# Altium schematic sheet GPSR_v2.SchDoc: Dual Antenna GPSR
size A3; CompanyName: NCTU; Address1: NCTU; DocumentNumber: 1; Revision: 1803; SheetNumber: 1; SheetTotal: 1
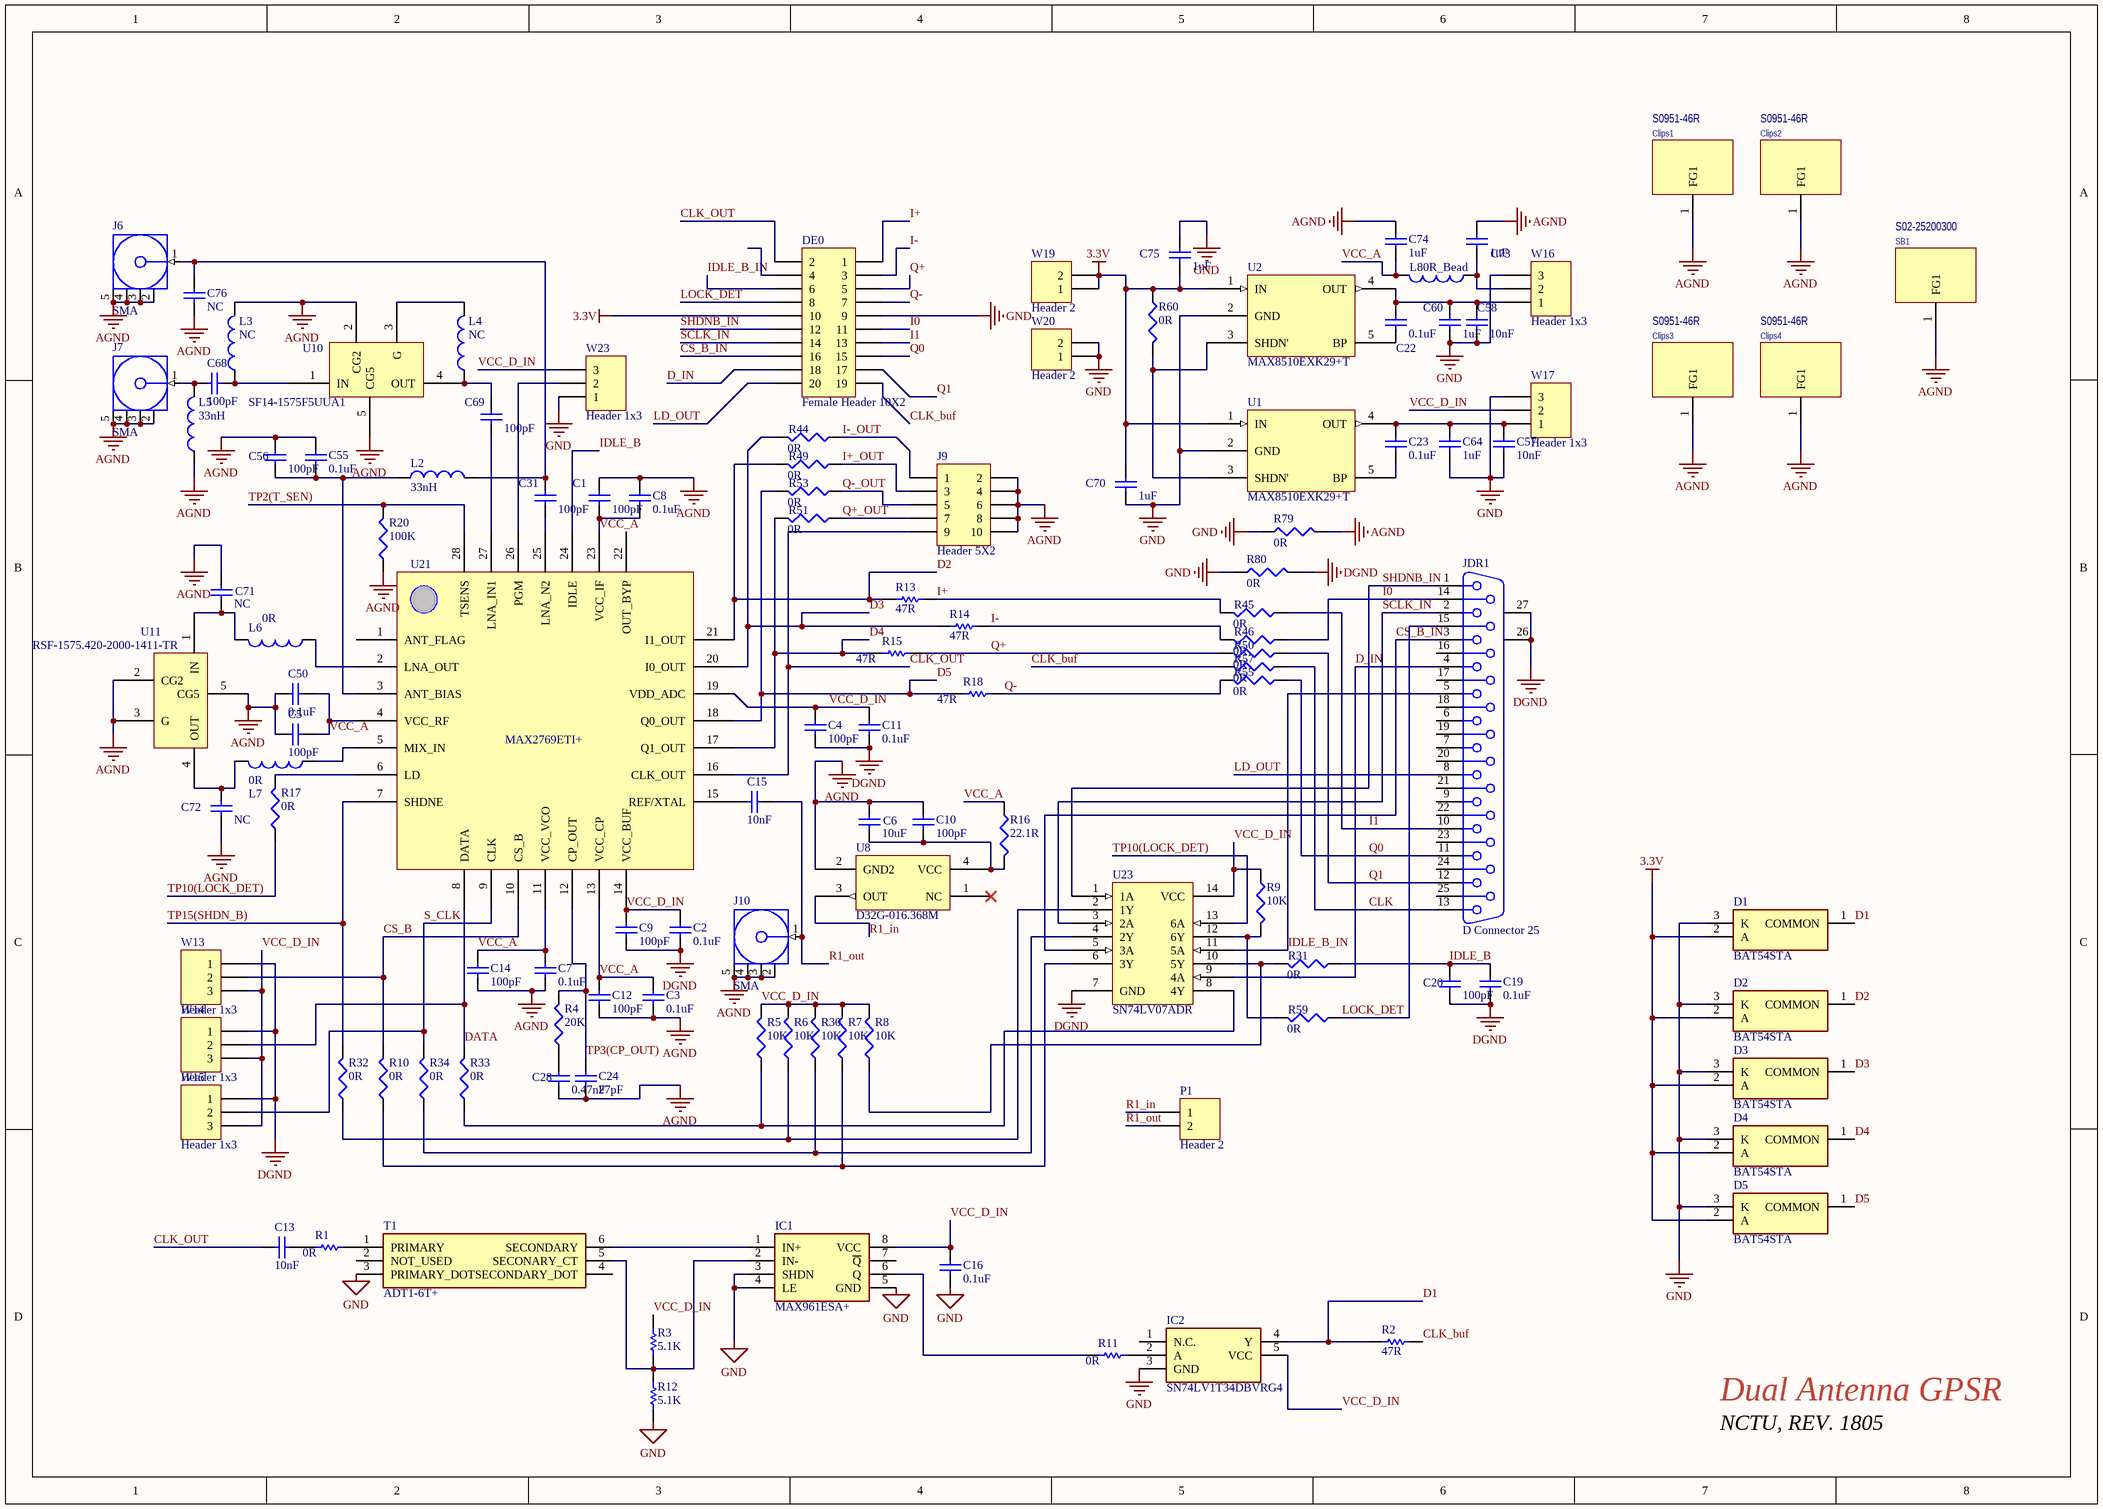
[diagram p0: GPSR_v2.SchDoc]

## Parts
C1  100pF  [C0402]
C2  0.1uF  [C0402]
C3  0.1uF  [C0402]
C4  100pF  [C0402]
C5  100pF  [C0402]
C6  10uF  [C0402]
C7  0.1uF  [C0402]
C8  0.1uF  [C0402]
C9  100pF  [C0402]
C10  100pF  [C0402]
C11  0.1uF  [C0402]
C12  100pF  [C0402]
C13  10nF  [C1210]
C14  100pF  [C0402]
C15  10nF  [C0402]
C16  0.1uF  [C1210]
C19  0.1uF  [C0402]
C20  100pF  [C0402]
C22  0.1uF  [C0402]
C23  0.1uF  [C0402]
C24  27pF  [C0402]
C28  0.47nF  [C0402]
C31  100pF  [C0402]
C50  0.1uF  [C0402]
C55  0.1uF  [C0402]
C56  100pF  [C0402]
C57  10nF  [C0402]
C58  10nF  [C0402]
C60  1uF  [C0402]
C64  1uF  [C0402]
C68  100pF  [C0402]
C69  100pF  [C0402]
C70  1uF  [C0402]
C71  NC  [C0402]
C72  NC  [C0402]
C73  1uF  [C0402]
C74  1uF  [C0402]
C75  1uF  [C0402]
C76  NC  [C0402]
Clips1  S0951-46R  [S0951-46R]
Clips2  S0951-46R  [S0951-46R]
Clips3  S0951-46R  [S0951-46R]
Clips4  S0951-46R  [S0951-46R]
D1  BAT54STA  [SOT23_M]
D2  BAT54STA  [SOT23_M]
D3  BAT54STA  [SOT23_M]
D4  BAT54STA  [SOT23_M]
D5  BAT54STA  [SOT23_M]
DE0  Female Header 10X2  [HDR2X10]
IC1  MAX961ESA+  [SOIC127P600X175-8N]
IC2  SN74LV1T34DBVRG4  [SOT95P280X145-5N]
J6  SMA  [SMA-JACK]
J7  SMA  [SMA-JACK]
J9  Header 5X2  [HDR2X5]
J10  SMA  [SMA-JACK]
JDR1  D Connector 25  [DSUB1.385-2H25A]
L2  33nH  [0402-A]
L3  NC  [0402-A]
L4  NC  [0402-A]
L5  33nH  [0402-A]
L6  0R  [0402-A]
L7  0R  [0402-A]
L8  0R_Bead  [0402-A]
P1  Header 2  [HDR1X2]
R1  0R  [6-0805_N]
R2  47R  [6-0805_N]
R3  5.1K  [6-0805_N]
R4  20K  [R0402]
R5  10K  [R0402]
R6  10K  [R0402]
R7  10K  [R0402]
R8  10K  [R0402]
R9  10K  [R0402]
R10  0R  [6-0805_N]
R11  0R  [6-0805_N]
R12  5.1K  [6-0805_N]
R13  47R  [6-0805_N]
R14  47R  [6-0805_N]
R15  47R  [6-0805_N]
R16  22.1R  [R0402]
R17  0R  [6-0805_N]
R18  47R  [6-0805_N]
R20  100K  [R0402]
R30  10K  [R0402]
R31  0R  [6-0805_N]
R32  0R  [6-0805_N]
R33  0R  [6-0805_N]
R34  0R  [6-0805_N]
R44  0R  [6-0805_N]
R45  0R  [6-0805_N]
R46  0R  [6-0805_N]
R49  0R  [6-0805_N]
R50  0R  [6-0805_N]
R51  0R  [6-0805_N]
R53  0R  [6-0805_N]
R55  0R  [6-0805_N]
R57  0R  [6-0805_N]
R59  0R  [6-0805_N]
R60  0R  [6-0805_N]
R79  0R  [6-0805_N]
R80  0R  [6-0805_N]
SB1  S02-25200300  [S02-25200300]
T1  ADT1-6T+  [ADT16T]
U1  MAX8510EXK29+T  [SOT65P210X110-5N]
U2  MAX8510EXK29+T  [SOT65P210X110-5N]
U8  D32G-016.368M  [OSC3225]
U10  SF14-1575F5UUA1  [SF141575F5UUA1]
U11  RSF-1575.420-2000-1411-TR  [SF141575F5UUA1]
U21  MAX2769ETI+  [TQFN28P$5C$0.5]
U23  SN74LV07ADR  [SOIC127P600X175-14N]
W13  Header 1x3  [HDR1X3]
W14  Header 1x3  [HDR1X3]
W15  Header 1x3  [HDR1X3]
W16  Header 1x3  [HDR1X3]
W17  Header 1x3  [HDR1X3]
W19  Header 2  [HDR1X2]
W20  Header 2  [HDR1X2]
W23  Header 1x3  [HDR1X3]

## Nets
3.3V: C70.2 C75.1 D1.2(A) D2.2(A) D3.2(A) D4.2(A) D5.2(A) DE0.10 R60.1 U1.1(IN) U2.1(IN) W19.1 W19.2
AGND: C1.2 C3.2 C5.2 C6.2 C7.2 C8.2 C10.2 C12.2 C14.2 C24.2 C28.2 C50.2 C55.2 C56.2 C71.2 C72.1 C73.1 C74.1 C76.1 Clips1.1(FG1) Clips2.1(FG1) Clips3.1(FG1) Clips4.1(FG1) J6.2(GND) J6.3(GND) J6.4(GND) J6.5(GND) J7.2(GND) J7.3(GND) J7.4(GND) J7.5(GND) J9.2 J9.4 J9.6 J9.8 J9.10 J10.2(GND) J10.3(GND) J10.4(GND) J10.5(GND) L3.2 L5.1 R20.1 R79.2 SB1.1(FG1) U8.2(GND2) U10.2(CG2) U10.5(CG5) U11.2(CG2) U11.3(G) U11.5(CG5)
DGND: C2.2 C4.2 C9.2 C11.2 C19.1 C20.1 JDR1.26(MH1) JDR1.27(MH2) R80.2 U23.7(GND) W13.1 W14.1 W15.1
GND: C16.1 C57.2 C58.2 C60.1 C64.1 C70.1 C75.2 D1.3(K) D2.3(K) D3.3(K) D4.3(K) D5.3(K) DE0.9 IC1.3(SHDN) IC1.4(LE) IC1.5(GND) IC2.3(GND) R12.1 R79.1 R80.1 T1.3(PRIMARY_DOT) U1.2(GND) U2.2(GND) W16.3 W17.3 W20.1 W20.2 W23.1
CLK: JDR1.13 R57.1
CLK_buf: DE0.19 R2.1 R57.2
CLK_OUT: C13.1 DE0.2 J9.9 U21.16(CLK_OUT)
CS_B: R10.2 U21.10(CS_B) W13.2
CS_B_IN: DE0.16 JDR1.3 U23.5(3A)
D1: D1.1(COMMON) IC2.4(Y) R2.2
D2: D2.1(COMMON) R13.2 R49.2 U21.21(I1_OUT)
D3: D3.1(COMMON) R14.2 R44.2 U21.20(I0_OUT)
D4: D4.1(COMMON) R15.2 R51.2 U21.17(Q1_OUT)
D5: D5.1(COMMON) R18.2 R53.2 U21.18(Q0_OUT)
D_IN: DE0.18 JDR1.4 U23.9(4A)
DATA: R33.2 U21.8(DATA) W14.2
I0: DE0.11 JDR1.14 R46.1
I1: DE0.13 JDR1.10 R45.1
I+: DE0.1 R13.1 R45.2
I+_OUT: J9.3 R49.1
I-: DE0.3 R14.1 R46.2
I-_OUT: J9.1 R44.1
IDLE_B: C19.2 C20.2 R31.1 U21.24(IDLE)
IDLE_B_IN: DE0.6 JDR1.5 U23.11(5A)
LD_OUT: DE0.20 JDR1.8
LOCK_DET: DE0.8 JDR1.15 R59.1
Q0: DE0.15 JDR1.11 R55.1
Q1: DE0.17 JDR1.12 R50.1
Q+: DE0.5 R15.1 R50.2
Q+_OUT: J9.7 R51.1
Q-: DE0.7 R18.1 R55.2
Q-_OUT: J9.5 R53.1
R1_in: P1.1 U8.3(OUT)
R1_out: C15.1 J10.1(Signal) P1.2
S_CLK: R34.2 U21.9(CLK) W15.2
SCLK_IN: DE0.14 JDR1.2 U23.3(2A)
SHDNB_IN: DE0.12 JDR1.1 U23.1(1A)
TP2(T_SEN): R20.2 U21.28(TSENS)
TP3(CP_OUT): C24.1 R4.2 U21.12(CP_OUT)
TP10(LOCK_DET): R17.1 U23.13(6A)
TP15(SHDN_B): R32.2 U21.7(SHDNE)
VCC_A: C1.1 C3.1 C5.1 C7.1 C8.1 C12.1 C14.1 C50.1 C74.2 L8.2 R16.1 U21.4(VCC_RF) U21.11(VCC_VCO) U21.13(VCC_CP) U21.23(VCC_IF)
VCC_D_IN: C2.1 C4.1 C9.1 C11.1 C16.2 IC1.8(VCC) IC2.5(VCC) R3.2 R5.2 R6.2 R7.2 R8.2 R9.1 R30.2 U21.14(VCC_BUF) U21.19(VDD_ADC) U23.14(VCC) W13.3 W14.3 W15.3 W17.2 W23.3
NetC6_1: C6.1 C10.1 R16.2 U8.4(VCC)
NetC13_2: C13.2 R1.1
NetC15_2: C15.2 U21.15(REF/XTAL)
NetC22_1: C22.1 C58.1 C60.2 U2.4(OUT) W16.1
NetC22_2: C22.2 U2.5(BP)
NetC23_1: C23.1 C57.1 C64.2 U1.4(OUT) W17.1
NetC23_2: C23.2 U1.5(BP)
NetC28_1: C28.1 R4.1
NetC31_1: C31.1 U21.25(LNA_N2)
NetC31_2: C31.2 C76.2 J6.1(Signal) L2.2
NetC55_1: C55.1 C56.1 L2.1 U21.3(ANT_BIAS)
NetC68_1: C68.1 L3.1 U10.1(IN)
NetC68_2: C68.2 J7.1(Signal) L5.2
NetC69_1: C69.1 U21.27(LNA_IN1)
NetC69_2: C69.2 L4.1 U10.4(OUT)
NetC71_1: C71.1 L6.2 U11.1(IN)
NetC72_2: C72.2 L7.2 U11.4(OUT)
NetC73_2: C73.2 L8.1 W16.2
NetIC1_1: IC1.1(IN+) T1.6(SECONDARY)
NetIC1_2: IC1.2(IN-) R3.1 R12.2 T1.5(SECONARY_CT)
NetIC1_6: IC1.6(Q) R11.1
NetIC2_2: IC2.2(A) R11.2
NetL4_2: L4.2 U10.3(G)
NetL6_1: L6.1 U21.2(LNA_OUT)
NetL7_1: L7.1 U21.5(MIX_IN)
NetR1_2: R1.2 T1.1(PRIMARY)
NetR5_1: R5.1 R33.1 U23.8(4Y)
NetR6_1: R6.1 R32.1 U23.2(1Y)
NetR7_1: R7.1 R10.1 U23.6(3Y)
NetR8_1: R8.1 R31.2 U23.10(5Y)
NetR9_2: R9.2 R59.2 U23.12(6Y)
NetR17_2: R17.2 U21.6(LD)
NetR30_1: R30.1 R34.1 U23.4(2Y)
NetR60_2: R60.2 U1.3(SHDN') U2.3(SHDN')
NetU21_26: U21.26(PGM) W23.2

Not connected (* = marked no-connect by the designer): DE0 4; IC1 7(~{Q}); IC2 1(N.C.); JDR1 6 7 9 16 17 18 19 20 21 22 23 24 25; T1 2(NOT_USED) 4(SECONDARY_DOT); U8 1(NC)*; U21 1(ANT_FLAG) 22(OUT_BYP)

## Notes on the sheet
- Dual Antenna GPSR
- NCTU, REV. 1805
- Sheet 1 of 1

## Library data of the parts
C1 C4 C5 C9 C10 C12 C14 C20 C31 C56 C68 C69 = Cap Semi: Capacitor (Semiconductor SIM Model); Value: 100p; Published: 8-Jun-2000; LatestRevisionDate: 29-May-2009; LatestRevisionNote: IPC-7351 Footprint Added.; PackageReference: C1206; Publisher: Altium Limited; PackageDescription: Chip Capacitor
C2 C3 C7 C8 C11 C19 C22 C23 C50 C55 = Cap Semi: Capacitor (Semiconductor SIM Model); Value: 0.1u; Published: 8-Jun-2000; LatestRevisionDate: 29-May-2009; LatestRevisionNote: IPC-7351 Footprint Added.; PackageReference: C1206; Publisher: Altium Limited; PackageDescription: Chip Capacitor
C6 = Cap Semi: Capacitor (Semiconductor SIM Model); Value: 10u; Published: 8-Jun-2000; LatestRevisionDate: 29-May-2009; LatestRevisionNote: IPC-7351 Footprint Added.; PackageReference: C1206; Publisher: Altium Limited; PackageDescription: Chip Capacitor
C13 C16 = Cap: Capacitor; Published: 8-Jun-2000; LatestRevisionDate: 17-Jul-2002; LatestRevisionNote: Re-released for DXP Platform.; PackageReference: RAD-0.3; Publisher: Altium Limited; PackageDescription: Radial Cap, Thru-Hole; 2 Leads; 0.3 in Pin Spacing
  C13: Value: 10nF
  C16: Value: 0.1uF
C15 = Cap Semi: Capacitor (Semiconductor SIM Model); Value: 10n; Published: 8-Jun-2000; LatestRevisionDate: 29-May-2009; LatestRevisionNote: IPC-7351 Footprint Added.; PackageReference: C1206; Publisher: Altium Limited; PackageDescription: Chip Capacitor
C24 = Cap Semi: Capacitor (Semiconductor SIM Model); Value: 27p; Published: 8-Jun-2000; LatestRevisionDate: 29-May-2009; LatestRevisionNote: IPC-7351 Footprint Added.; PackageReference: C1206; Publisher: Altium Limited; PackageDescription: Chip Capacitor
C28 = Cap Semi: Capacitor (Semiconductor SIM Model); Value: 0.47n; Published: 8-Jun-2000; LatestRevisionDate: 29-May-2009; LatestRevisionNote: IPC-7351 Footprint Added.; PackageReference: C1206; Publisher: Altium Limited; PackageDescription: Chip Capacitor
C57 C58 = Cap Semi: Capacitor (Semiconductor SIM Model); Value: 0.01u; Published: 8-Jun-2000; LatestRevisionDate: 29-May-2009; LatestRevisionNote: IPC-7351 Footprint Added.; PackageReference: C1206; Publisher: Altium Limited; PackageDescription: Chip Capacitor
C60 C64 C70 C73-C75 = Cap Semi: Capacitor (Semiconductor SIM Model); Value: 1u; Published: 8-Jun-2000; LatestRevisionDate: 29-May-2009; LatestRevisionNote: IPC-7351 Footprint Added.; PackageReference: C1206; Publisher: Altium Limited; PackageDescription: Chip Capacitor
C71 C72 C76 = Cap Semi: Capacitor (Semiconductor SIM Model); Value: Open; Published: 8-Jun-2000; LatestRevisionDate: 29-May-2009; LatestRevisionNote: IPC-7351 Footprint Added.; PackageReference: C1206; Publisher: Altium Limited; PackageDescription: Chip Capacitor
Clips1-Clips4 SB1 = ShieldingBox-3pin-27x17
D1-D5 = BAT54STA: Schottky Diode; Manufacturer_Name: Diodes Inc.; Datasheet Link: https://www.diodes.com/assets/Datasheets/bat54srs.pdf; Height: 0mm; Manufacturer_Part_Number: BAT54STA; Mouser Part Number: 522-BAT54STA; Mouser Price/Stock: https://www.mouser.co.uk/ProductDetail/Diodes-Incorporated/BAT54STA?qs=CUBnOrq4ZJw2cocvHtDEgQ%3D%3D; Arrow Part Number: BAT54STA; Arrow Price/Stock: https://www.arrow.com/en/products/bat54sta/diodes-incorporated
DE0 = Header 10X2: Female Header, 10-Pin, Dual row; LatestRevisionDate: 17-Jul-2002; LatestRevisionNote: Re-released for DXP Platform.; Publisher: Altium Limited
IC1 = MAX961ESA+: Integrated Circuit; Manufacturer_Name: Maxim Integrated; Datasheet Link: http://datasheets.maximintegrated.com/en/ds/MAX961-MAX999.pdf; Height: 1.75mm; Manufacturer_Part_Number: MAX961ESA+; Mouser Part Number: 700-MAX961ESA; Mouser Price/Stock: https://www.mouser.co.uk/ProductDetail/Maxim-Integrated/MAX961ESA%2b?qs=1THa7WoU59FG2p1IWSYQMw%3D%3D
IC2 = SN74LV1T34DBVRG4: Integrated Circuit; Manufacturer_Name: Texas Instruments; Datasheet Link: http://www.ti.com/lit/gpn/sn74lv1t34; Height: 1.45mm; Manufacturer_Part_Number: SN74LV1T34DBVRG4; Mouser Part Number: 595-SN74LV1T34DBVRG4; Mouser Price/Stock: https://www.mouser.co.uk/ProductDetail/Texas-Instruments/SN74LV1T34DBVRG4?qs=vdi0iO8H4N10R%252Bt%252BjmxZrg%3D%3D; Arrow Part Number: SN74LV1T34DBVRG4; Arrow Price/Stock: https://www.arrow.com/en/products/sn74lv1t34dbvrg4/texas-instruments?region=nac
J6 J7 J10 = COAX-F: PCB_Layout: Complies with manufacturer's recommendation.; DrillSize: Corresponds to nominal value.; Published: 15-Jul-2004; LatestRevisionDate: 15-Jul-2004; LatestRevisionNote: Component Replaced.; DatasheetDocument: 30-May-2003; PackageDocument: 04-Jul-1999; PackageReference: 919-119J-51AX; Publisher: Altium Limited; ComponentLink1Description: Manufacturer Link; ComponentLink1URL: http://www.amphenolrf.com/
J9 = Header 5X2: Header, 5-Pin, Dual row; LatestRevisionDate: 17-Jul-2002; LatestRevisionNote: Re-released for DXP Platform.; Publisher: Altium Limited
JDR1 = D Connector 25: Receptacle Assembly, 25 Position, Right Angle; PackageDocument: U; Positions: 25; Published: 15-Jun-2001; LatestRevisionDate: 17-Jul-2002; LatestRevisionNote: Re-released for DXP Platform.; DatasheetDocument: 19-Mar-1999; PackageReference: 787202; Publisher: Altium Limited; Orientation: Right Angle; Gender: Receptacle
L2 L5-L7 = Inductor: Code_IEC: 1005; Published: 8-Jun-2000; LatestRevisionDate: 29-May-2009; LatestRevisionNote: IPC-7351 Footprint Added.; PackageReference: 0402-A; Publisher: Altium Limited; PackageDescription: Chip Inductor; Code_JEITA: 0402
  L2 L5: Value: 33nH
  L6 L7: Value: 0R
L3 L4 = Inductor: Code_IEC: 1005; Value: Open; Published: 8-Jun-2000; LatestRevisionDate: 29-May-2009; LatestRevisionNote: IPC-7351 Footprint Added.; PackageReference: 0402-A; Publisher: Altium Limited; PackageDescription: Chip Inductor; Code_JEITA: 0402
L8 = Inductor: Code_IEC: 1005; Value: 0R bead; Published: 8-Jun-2000; LatestRevisionDate: 29-May-2009; LatestRevisionNote: IPC-7351 Footprint Added.; PackageReference: 0402-A; Publisher: Altium Limited; PackageDescription: Chip Inductor; Code_JEITA: 0402
P1 W19 W20 = Header 2: Header, 2-Pin; LatestRevisionDate: 17-Jul-2002; LatestRevisionNote: Re-released for DXP Platform.; Publisher: Altium Limited
R1 R3 R11 R12 = Res1: Resistor; Published: 8-Jun-2000; LatestRevisionDate: 17-Jul-2002; LatestRevisionNote: Re-released for DXP Platform.; PackageReference: AXIAL-0.3; Publisher: Altium Limited; PackageDescription: Axial Device, Thru-Hole; 2 Leads; 0.3 in Pin Spacing
  R1 R11: Value: 0R
  R3 R12: Value: 5.1K
R2 R13-R15 R18 = Res1: Resistor; Value: 47Ω; Published: 8-Jun-2000; LatestRevisionDate: 17-Jul-2002; LatestRevisionNote: Re-released for DXP Platform.; PackageReference: AXIAL-0.3; Publisher: Altium Limited; PackageDescription: Axial Device, Thru-Hole; 2 Leads; 0.3 in Pin Spacing
R4-R10 R17 R20 R30-R34 R44-R46 R49-R51 R53 R55 R57 R59 R60 R79 R80 = Res3: Resistor; Published: 8-Jun-2000; LatestRevisionDate: 29-May-2009; LatestRevisionNote: IPC-7351 Footprint Added.; PackageReference: J1-0603; Publisher: Altium Limited; PackageDescription: Chip Resistor
  R4: Value: 20k
  R5-R9 R30: Value: 10k
  R10 R17 R31-R34 R44-R46 R49-R51 R53 R55 R57 R59 R60 R79 R80: Value: 0R
  R20: Value: 100k
R16 = Res3: Resistor; Value: 22.1; Published: 8-Jun-2000; LatestRevisionDate: 29-May-2009; LatestRevisionNote: IPC-7351 Footprint Added.; PackageReference: J1-0603; Publisher: Altium Limited; PackageDescription: Chip Resistor
T1 = ADT1-6T+: Transformer; Manufacturer_Name: Mini-Circuits; Datasheet Link: https://www.minicircuits.com/WebStore/dashboard.html?model=ADT1-6T%2B; Manufacturer_Part_Number: ADT1-6T+; Mouser Part Number: 139-ADT1-6T; Mouser Price/Stock: https://www.mouser.co.uk/ProductDetail/Mini-Circuits/ADT1-6T%2b?qs=xZ%2FP%252Ba9zWqaFnE78654XUA%3D%3D
U1 U2 = MAX8510EXK29+
U8 U10 U11 = Component_1
U21 = MAX2769ETI+: GPS IC
W13-W17 W23 = Header 3: Header, 3-Pin; LatestRevisionDate: 17-Jul-2002; LatestRevisionNote: Re-released for DXP Platform.; Publisher: Altium Limited